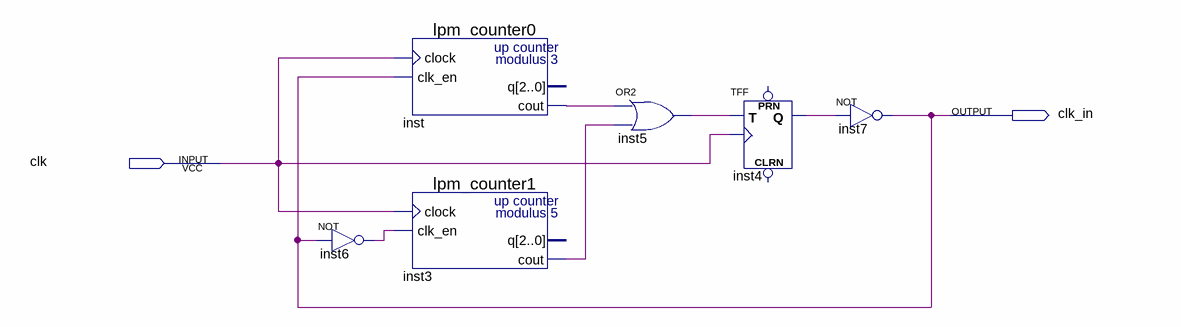
[diagram p0: schematic sheet]
// Quartus schematic block1.bdf as structural Verilog: 6 symbols, 2 pins
module block1 (
  input  clk,
  output clk_in
);

  wire inst3_cout, inst4_q, inst5_out, inst6_out, inst_cout;

  not inst6 (inst6_out, clk_in);
  lpm_counter0 inst (.clock(clk), .clk_en(clk_in), .cout(inst_cout));  // open: q
  lpm_counter1 inst3 (.clock(clk), .clk_en(inst6_out), .cout(inst3_cout));  // open: q
  or inst5 (inst5_out, inst_cout, inst3_cout);
  TFF inst4 (.T(inst5_out), .CLK(clk), .Q(inst4_q));  // open: PRN, CLRN
  not inst7 (clk_in, inst4_q);
endmodule
